# Altium schematic sheet CircuitForPowermeter.SchDoc: CircuitForPowerMeter
size A4; Date: 19.06.2020; DrawnBy: Baris; Organization: espros photonics AG; Address1: St. Gallerstrasse 135; Address2: 7320 Sargans; Address3: Switzerland; DocumentNumber: 69; Revision: V1.1; SheetNumber: 1; SheetTotal: 1
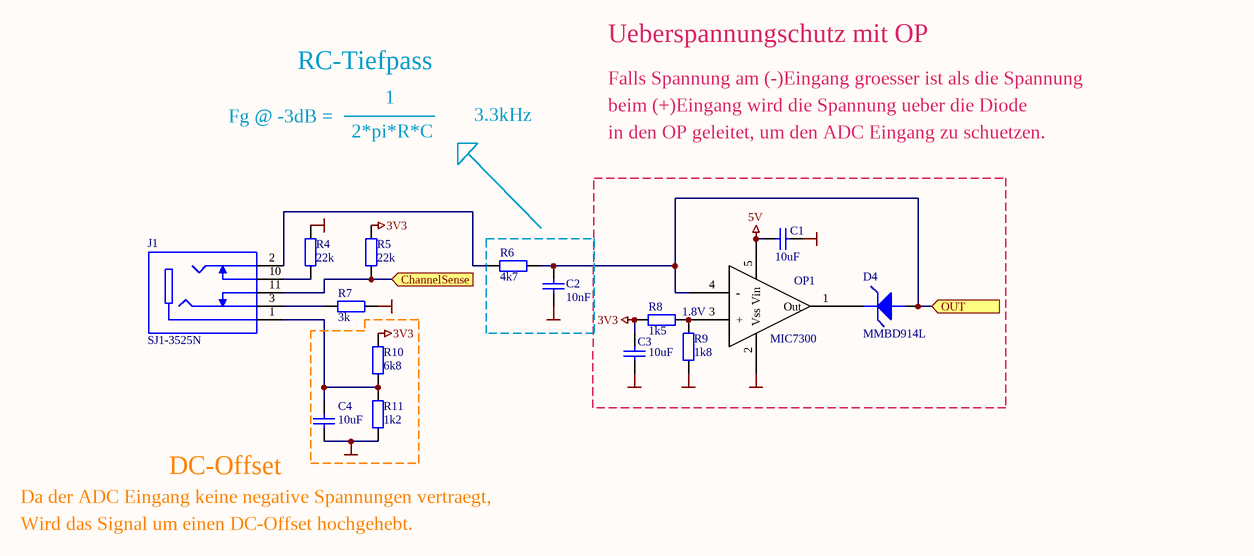
[diagram p0: CircuitForPowermeter.SchDoc]

## Parts
C1  10uF  [1206_C]
C2  10nF  [0805]
C3  10uF  [1206_C]
C4  10uF  [1206_C]
D4  MMBD914L  [SOT-23]
J1  SJ1-3525N  [CUI_SJ1-3525N]
OP1  MIC7300  [SOT-23-5]
R4  22k  [0805_R]
R5  22k  [0805_R]
R6  4k7  [0805_R]
R7  3k  [0805_R]
R8  1k5  [0805_R]
R9  1k8  [0805_R]
R10  6k8  [0805_R]
R11  1k2  [0805_R]

## Blocks framed on the sheet
1.8V: C1 C3 D4 OP1 R8 R9

## Ports
ChannelSense (in), OUT (in)

## Nets
3V3: C3.2 R5.1 R8.1 R10.2
5V: C1.1 OP1.5(Vin)
NetC1_2: C1.2 C2.1 C3.1 C4.1 OP1.2(Vss) R4.1 R7.1 R9.1 R11.1
ChannelSense: J1.11 R5.2 ; port ChannelSense
OUT: C2.2 D4.1(A) OP1.4(-) R6.2 ; port OUT
NetC4_2: C4.2 J1.1 R10.1 R11.2
NetD4_3: D4.3(K) OP1.1(Out)
NetJ1_2: J1.2 R6.1
NetJ1_3: J1.3 R7.2
NetJ1_10: J1.10 R4.2
NetOP1_3: OP1.3(+) R8.2 R9.2

Not connected (* = marked no-connect by the designer): D4 2(NC)

## Notes on the sheet
- RC-Tiefpass
- Ueberspannungschutz mit OP
- Falls Spannung am (-)Eingang groesser ist als die Spannung
- Fg @ -3dB =
- 2*pi*R*C
- 1
- 3.3kHz
- beim (+)Eingang wird die Spannung ueber die Diode
- in den OP geleitet, um den ADC Eingang zu schuetzen.
- (near C4) DC-Offset
- Da der ADC Eingang keine negative Spannungen vertraegt,
- Wird das Signal um einen DC-Offset hochgehebt.
- Title:
- Number:
- Drawn by:
- Revision:
- Date:
- Sheet
- of
- File:

## Library data of the parts
C1-C4 = C: Capacitor; Tolerance: *; Voltage Rating: *; Ceramic: *; Manufacturer 1: *; Manufacturer 1 Part No.: *; Distributor 1: *; Distributor 1 Part No.: *
  C1 C3 C4: Value: 10uF
  C2: Value: 10nF
D4 = BZX84-B10: High-Speed Switching  Diode; Art-Nummer: No; Hersteller: MMBD914L; Bestell-Bezeichnung: MMBD914L
J1 = SJ1-3525N: 3.5 mm, Stereo, Right Angle, Through Hole, Audio Jack Connector; MF: CUI Devices; Package: None; Price: None; Availability: Unavailable; MP: SJ1-3525N; CUI_purchase_URL: https://www.cuidevices.com/product/interconnect/connectors/audio-connectors/jacks/sj1-352xn-series?utm_source=snapeda.com&utm_medium=referral&utm_campaign=snapedaBOM; SnapEDA_Link: https://www.snapeda.com/parts/SJ1-3525N/CUI%20Devices/view-part/231506/?ref=snap; Value: *
OP1 = Component_1
R4 R5 = R: Resistor; Value: 15k; Power Rating: *; Tolerance: *; Manufacturer 1: *; Manufacturer 1 Part No.: *; Distributor 1: *; Distributor 1 Part No.: *
R6-R11 = R: Resistor; Power Rating: *; Tolerance: *; Manufacturer 1: *; Manufacturer 1 Part No.: *; Distributor 1: *; Distributor 1 Part No.: *
  R6: Value: 4k7
  R7: Value: 3k
  R8: Value: 1k5
  R9: Value: 1k8
  R10: Value: 6k8
  R11: Value: 1k2